# EAGLE design light_controller (EAGLE 8.4.0)
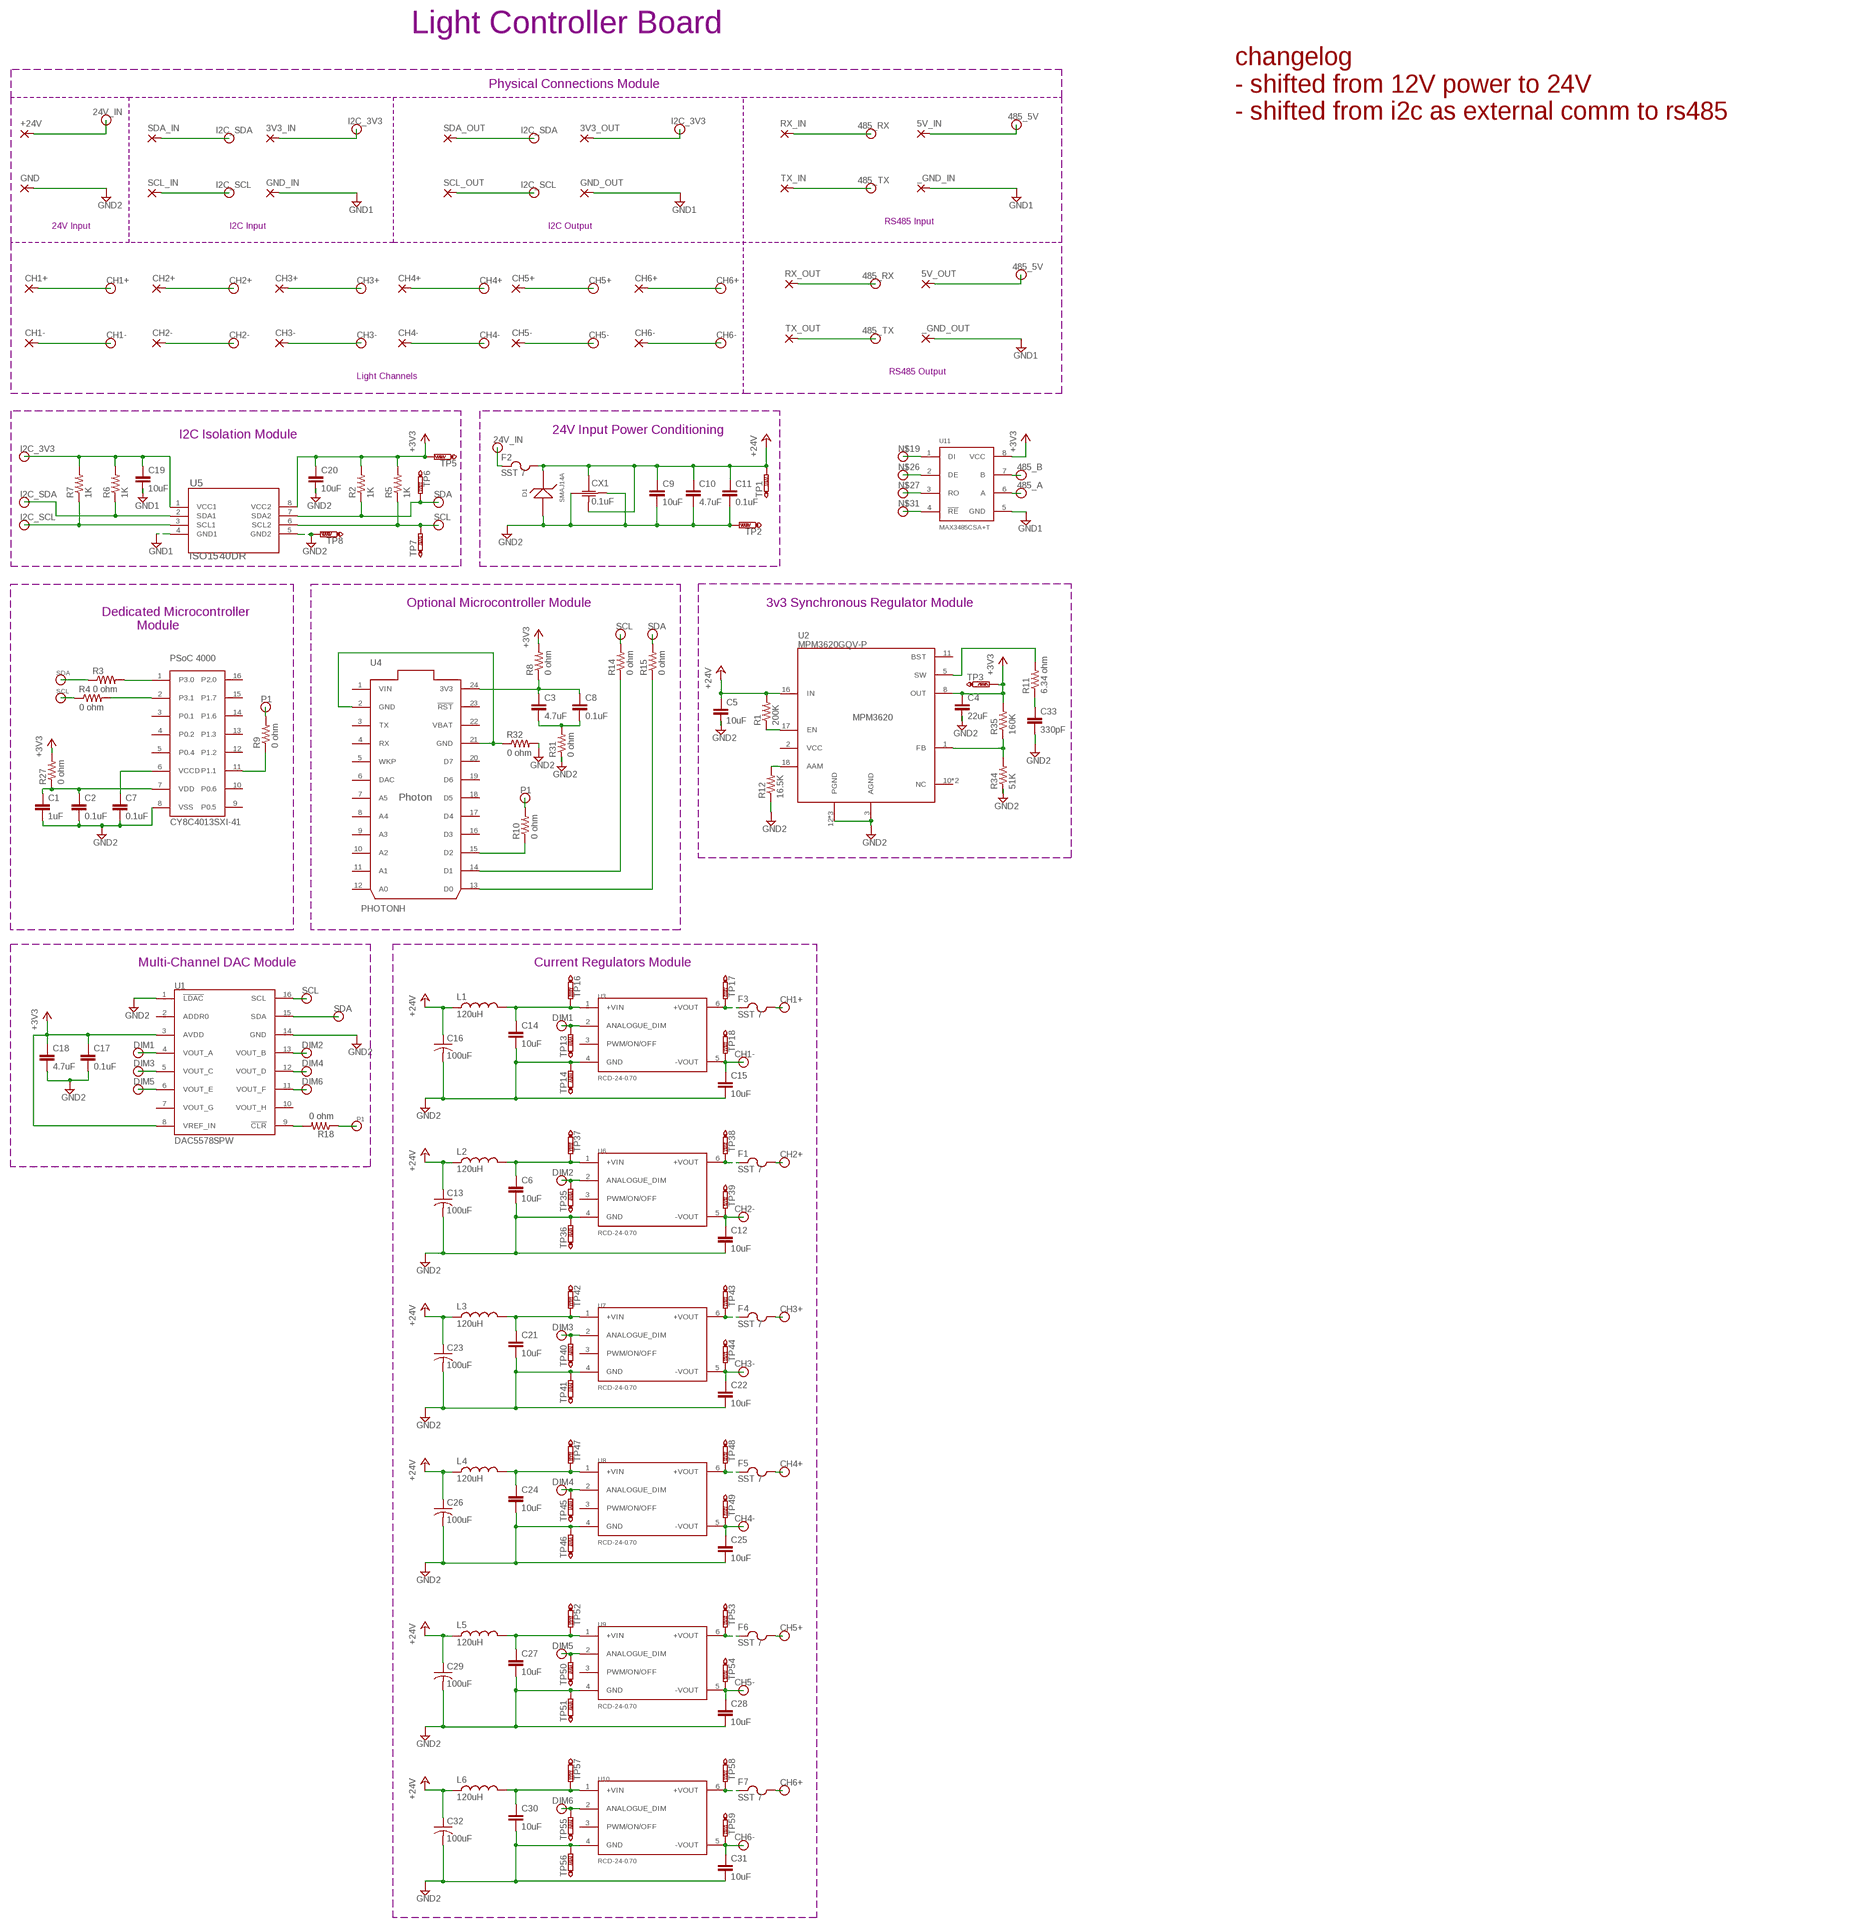
[diagram p0: schematic, sheet 1]

## Parts
3V3_IN  3,17/1,3  [3,17/1,3]
3V3_OUT  3,17/1,3  [3,17/1,3]
5V_IN  3,17/1,3  [3,17/1,3]
5V_OUT  3,17/1,3  [3,17/1,3]
+24V  3,17/1,3  [3,17/1,3]
_GND_IN  3,17/1,3  [3,17/1,3]
_GND_OUT  3,17/1,3  [3,17/1,3]
C1  1uF  1UF-CL10A105KB8NNNC  [C1206]
C2  0.1uF  0.1UF-C1206C104K5RAC7867  [C1206C]
C3  4.7uF  4.7UF-C1206C475K5PACTU  [CAP_C1206]
C4  22uF  22UF-C3216X5R1V226M160AC  [C1206]
C5  10uF  10UF-CL31B106KBHNNNE  [C1206]
C6  10uF  10UF-CL31B106KBHNNNE  [C1206]
C7  0.1uF  0.1UF-C1206C104K5RAC7867  [C1206C]
C8  0.1uF  0.1UF-C1206C104K5RAC7867  [C1206C]
C9  10uF  10UF-CL31B106KBHNNNE  [C1206]
C10  4.7uF  4.7UF-C1206C475K5PACTU  [CAP_C1206]
C11  0.1uF  0.1UF-C1206C104K5RAC7867  [C1206C]
C12  10uF  10UF-CL31B106KBHNNNE  [C1206]
C13  100uF  100UF-EEE-1HA101UP  [EEE-1HA101UP]
C14  10uF  10UF-CL31B106KBHNNNE  [C1206]
C15  10uF  10UF-CL31B106KBHNNNE  [C1206]
C16  100uF  100UF-EEE-1HA101UP  [EEE-1HA101UP]
C17  0.1uF  0.1UF-C1206C104K5RAC7867  [C1206C]
C18  4.7uF  4.7UF-C1206C475K5PACTU  [CAP_C1206]
C19  10uF  10UF-CL31B106KBHNNNE  [C1206]
C20  10uF  10UF-CL31B106KBHNNNE  [C1206]
C21  10uF  10UF-CL31B106KBHNNNE  [C1206]
C22  10uF  10UF-CL31B106KBHNNNE  [C1206]
C23  100uF  100UF-EEE-1HA101UP  [EEE-1HA101UP]
C24  10uF  10UF-CL31B106KBHNNNE  [C1206]
C25  10uF  10UF-CL31B106KBHNNNE  [C1206]
C26  100uF  100UF-EEE-1HA101UP  [EEE-1HA101UP]
C27  10uF  10UF-CL31B106KBHNNNE  [C1206]
C28  10uF  10UF-CL31B106KBHNNNE  [C1206]
C29  100uF  100UF-EEE-1HA101UP  [EEE-1HA101UP]
C30  10uF  10UF-CL31B106KBHNNNE  [C1206]
C31  10uF  10UF-CL31B106KBHNNNE  [C1206]
C32  100uF  100UF-EEE-1HA101UP  [EEE-1HA101UP]
C33  330pF  330PF-CC1206KRX7R9BB331  [C1206]
CH1+  3,17/1,3  [3,17/1,3]
CH1-  3,17/1,3  [3,17/1,3]
CH2+  3,17/1,3  [3,17/1,3]
CH2-  3,17/1,3  [3,17/1,3]
CH3+  3,17/1,3  [3,17/1,3]
CH3-  3,17/1,3  [3,17/1,3]
CH4+  3,17/1,3  [3,17/1,3]
CH4-  3,17/1,3  [3,17/1,3]
CH5+  3,17/1,3  [3,17/1,3]
CH5-  3,17/1,3  [3,17/1,3]
CH6+  3,17/1,3  [3,17/1,3]
CH6-  3,17/1,3  [3,17/1,3]
CX1  0.1uF  0.1UF-X2Y-CX1206MKX7R9BB104  [CX1206]
D1  SMAJ14A  [DO-214AC]
F1  SST 7  SST_7  [SS]
F2  SST 7  SST_7  [SS]
F3  SST 7  SST_7  [SS]
F4  SST 7  SST_7  [SS]
F5  SST 7  SST_7  [SS]
F6  SST 7  SST_7  [SS]
F7  SST 7  SST_7  [SS]
GND  3,17/1,3  [3,17/1,3]
GND_IN  3,17/1,3  [3,17/1,3]
GND_OUT  3,17/1,3  [3,17/1,3]
L1  120uH  120UH-74404064121  [74404064121]
L2  120uH  120UH-74404064121  [74404064121]
L3  120uH  120UH-74404064121  [74404064121]
L4  120uH  120UH-74404064121  [74404064121]
L5  120uH  120UH-74404064121  [74404064121]
L6  120uH  120UH-74404064121  [74404064121]
R1  200K  200K-RC0603JR-07200KL  [RC0603N]
R2  1K  1K-ERJ-PB3D1001V  [RC0603N]
R3  0 ohm  0OHM-ERJ-3GEY0R00V  [RC0603N]
R4  0 ohm  0OHM-ERJ-3GEY0R00V  [RC0603N]
R5  1K  1K-ERJ-PB3D1001V  [RC0603N]
R6  1K  1K-ERJ-PB3D1001V  [RC0603N]
R7  1K  1K-ERJ-PB3D1001V  [RC0603N]
R8  0 ohm  0OHM-ERJ-3GEY0R00V  [RC0603N]
R9  0 ohm  0OHM-ERJ-3GEY0R00V  [RC0603N]
R10  0 ohm  0OHM-ERJ-3GEY0R00V  [RC0603N]
R11  6.34 ohm  6.3OHM-RC0805FR-076R34L  [R0805]
R12  16.5K  16.5K-311-16.5KHRCT-ND  [RC0603N]
R14  0 ohm  0OHM-ERJ-3GEY0R00V  [RC0603N]
R15  0 ohm  0OHM-ERJ-3GEY0R00V  [RC0603N]
R18  0 ohm  0OHM-ERJ-3GEY0R00V  [RC0603N]
R27  0 ohm  0OHM-ERJ-3GEY0R00V  [RC0603N]
R31  0 ohm  0OHM-ERJ-3GEY0R00V  [RC0603N]
R32  0 ohm  0OHM-ERJ-3GEY0R00V  [RC0603N]
R34  51K  51K-RC0603JR-0751KL  [RC0603N]
R35  160K  160K-RC0603JR-07160KL  [RC0603N]
RX_IN  3,17/1,3  [3,17/1,3]
RX_OUT  3,17/1,3  [3,17/1,3]
SCL_IN  3,17/1,3  [3,17/1,3]
SCL_OUT  3,17/1,3  [3,17/1,3]
SDA_IN  3,17/1,3  [3,17/1,3]
SDA_OUT  3,17/1,3  [3,17/1,3]
TP1  PTR1B2,54  [B2,54]
TP2  PTR1B2,54  [B2,54]
TP3  PTR1B2,54  [B2,54]
TP5  PTR1B2,54  [B2,54]
TP6  PTR1B2,54  [B2,54]
TP7  PTR1B2,54  [B2,54]
TP8  PTR1B2,54  [B2,54]
TP13  PTR1B2,54  [B2,54]
TP14  PTR1B2,54  [B2,54]
TP16  PTR1B2,54  [B2,54]
TP17  PTR1B2,54  [B2,54]
TP18  PTR1B2,54  [B2,54]
TP35  PTR1B2,54  [B2,54]
TP36  PTR1B2,54  [B2,54]
TP37  PTR1B2,54  [B2,54]
TP38  PTR1B2,54  [B2,54]
TP39  PTR1B2,54  [B2,54]
TP40  PTR1B2,54  [B2,54]
TP41  PTR1B2,54  [B2,54]
TP42  PTR1B2,54  [B2,54]
TP43  PTR1B2,54  [B2,54]
TP44  PTR1B2,54  [B2,54]
TP45  PTR1B2,54  [B2,54]
TP46  PTR1B2,54  [B2,54]
TP47  PTR1B2,54  [B2,54]
TP48  PTR1B2,54  [B2,54]
TP49  PTR1B2,54  [B2,54]
TP50  PTR1B2,54  [B2,54]
TP51  PTR1B2,54  [B2,54]
TP52  PTR1B2,54  [B2,54]
TP53  PTR1B2,54  [B2,54]
TP54  PTR1B2,54  [B2,54]
TP55  PTR1B2,54  [B2,54]
TP56  PTR1B2,54  [B2,54]
TP57  PTR1B2,54  [B2,54]
TP58  PTR1B2,54  [B2,54]
TP59  PTR1B2,54  [B2,54]
TX_IN  3,17/1,3  [3,17/1,3]
TX_OUT  3,17/1,3  [3,17/1,3]
U1  DAC5578SPW  [TSSOP16]
U2  MPM3620GQV-P  [20-POWERLFQFN-MODULE]
U3  RCD-24-0.70  [RCD-24-PINNED]
U4  PHOTONH  PHOTONHPHOTONH  [PHOTON]
U5  ISO1540DR  [D8]
U6  RCD-24-0.70  [RCD-24-PINNED]
U7  RCD-24-0.70  [RCD-24-PINNED]
U8  RCD-24-0.70  [RCD-24-PINNED]
U9  RCD-24-0.70  [RCD-24-PINNED]
U10  RCD-24-0.70  [RCD-24-PINNED]
U11  MAX3485CSA+T  [SOIC8]
U$2  CY8C4013SXI-41  [SOIC16]

## Nets
24V_IN: +24V.1(P) F2.1
485_5V: 5V_IN.1(P) 5V_OUT.1(P)
485_A: U11.6(A)
485_B: U11.7(B)
485_RX: RX_IN.1(P) RX_OUT.1(P)
485_TX: TX_IN.1(P) TX_OUT.1(P)
+3V3: C4.1 C17.1 C18.1 C20.1 R2.2 R5.2 R8.2 R27.2 R35.2 TP3.TP TP5.TP U1.3(AVDD) U1.8(VREF_IN) U2.8(OUT) U5.8(VCC2) U11.8(VCC)
+24V: C5.1 C9.1 C10.1 C11.1 C13.+(1(+)) C16.+(1(+)) C23.+(1(+)) C26.+(1(+)) C29.+(1(+)) C32.+(1(+)) CX1.1 CX1.2 D1.C F2.2 L1.1 L2.1 L3.1 L4.1 L5.1 L6.1 R1.2 TP1.TP U2.16(IN)
CH1+: CH1+.1(P) F3.2
CH1-: C15.1 CH1-.1(P) TP18.TP U3.5(-VOUT)
CH2+: CH2+.1(P) F1.2
CH2-: C12.1 CH2-.1(P) TP39.TP U6.5(-VOUT)
CH3+: CH3+.1(P) F4.2
CH3-: C22.1 CH3-.1(P) TP44.TP U7.5(-VOUT)
CH4+: CH4+.1(P) F5.2
CH4-: C25.1 CH4-.1(P) TP49.TP U8.5(-VOUT)
CH5+: CH5+.1(P) F6.2
CH5-: C28.1 CH5-.1(P) TP54.TP U9.5(-VOUT)
CH6+: CH6+.1(P) F7.2
CH6-: C31.1 CH6-.1(P) TP59.TP U10.5(-VOUT)
DIM1: TP13.TP U1.4(VOUT_A) U3.2(ANALOGUE_DIM)
DIM2: TP35.TP U1.13(VOUT_B) U6.2(ANALOGUE_DIM)
DIM3: TP40.TP U1.5(VOUT_C) U7.2(ANALOGUE_DIM)
DIM4: TP45.TP U1.12(VOUT_D) U8.2(ANALOGUE_DIM)
DIM5: TP50.TP U1.6(VOUT_E) U9.2(ANALOGUE_DIM)
DIM6: TP55.TP U1.11(VOUT_F) U10.2(ANALOGUE_DIM)
GND1: _GND_IN.1(P) _GND_OUT.1(P) C19.2 GND_IN.1(P) GND_OUT.1(P) U5.4(GND1) U11.5(GND)
GND2: C1.2 C2.2 C4.2 C5.2 C6.2 C7.2 C9.2 C10.2 C11.2 C12.2 C13.-(2(-)) C14.2 C15.2 C16.-(2(-)) C17.2 C18.2 C20.2 C21.2 C22.2 C23.-(2(-)) C24.2 C25.2 C26.-(2(-)) C27.2 C28.2 C29.-(2(-)) C30.2 C31.2 C32.-(2(-)) C33.2 CX1.3 CX1.4 D1.A GND.1(P) R12.1 R31.1 R32.2 R34.1 TP2.TP TP8.TP TP14.TP TP36.TP TP41.TP TP46.TP TP51.TP TP56.TP U1.1(!LDAC!) U1.14(GND) U2.3(AGND) U2.12(PGND) U2.13(PGND) U2.14(PGND) U3.4(GND) U5.5(GND2) U6.4(GND) U7.4(GND) U8.4(GND) U9.4(GND) U10.4(GND) U$2.8(VSS)
I2C_3V3: 3V3_IN.1(P) 3V3_OUT.1(P) C19.1 R6.2 R7.2 U5.1(VCC1)
I2C_SCL: R7.1 SCL_IN.1(P) SCL_OUT.1(P) U5.3(SCL1)
I2C_SDA: R6.1 SDA_IN.1(P) SDA_OUT.1(P) U5.2(SDA1)
N$1: R3.2 U$2.1(P3.0)
N$2: R4.2 U$2.2(P3.1)
N$3: C14.1 L1.2 TP16.TP U3.1(+VIN)
N$4: R9.1 U$2.11(P1.1)
N$5: F3.1 TP17.TP U3.6(+VOUT)
N$6: C6.1 L2.2 TP37.TP U6.1(+VIN)
N$7: R10.1 U4.15(D2)
N$8: R18.2 U1.9(!CLR!)
N$9: F1.1 TP38.TP U6.6(+VOUT)
N$10: C21.1 L3.2 TP42.TP U7.1(+VIN)
N$11: F4.1 TP43.TP U7.6(+VOUT)
N$12: C24.1 L4.2 TP47.TP U8.1(+VIN)
N$13: F5.1 TP48.TP U8.6(+VOUT)
N$14: C27.1 L5.2 TP52.TP U9.1(+VIN)
N$15: R11.2 U2.5(SW)
N$16: C1.1 C2.1 R27.1 U$2.7(VDD)
N$17: C33.1 R11.1
N$18: R12.2 U2.18(AAM)
N$19: U11.1(DI)
N$20: C3.2 C8.2 R31.2
N$21: F6.1 TP53.TP U9.6(+VOUT)
N$22: R14.1 U4.14(D1)
N$23: C3.1 C8.1 R8.1 U4.24(3V3)
N$24: C30.1 L6.2 TP57.TP U10.1(+VIN)
N$25: F7.1 TP58.TP U10.6(+VOUT)
N$26: U11.2(DE)
N$27: U11.3(RO)
N$28: R15.1 U4.13(D0)
N$29: C7.1 U$2.6(VCCD)
N$30: R32.1 U4.2(GND) U4.21(GND)
N$31: U11.4(!RE!)
N$32: R1.1 U2.17(EN)
N$33: R34.2 R35.1 U2.1(FB)
P1: R9.2 R10.2 R18.1
SCL: R4.1 R5.1 R14.2 TP7.TP U1.16(SCL) U5.6(SCL2)
SDA: R2.1 R3.1 R15.2 TP6.TP U1.15(SDA) U5.7(SDA2)
Unconnected: U1.2(ADDR0) U1.7(VOUT_G) U1.10(VOUT_H) U2.2(VCC) U2.10(NC) U2.11(BST) U2.15(NC) U3.3(PWM/ON/OFF) U4.3(TX) U4.4(RX) U4.5(WKP) U4.6(DAC) U4.7(A5) U4.8(A4) U4.9(A3) U4.10(A2) U4.11(A1) U4.12(A0) U4.16(D3) U4.17(D4) U4.18(D5) U4.19(D6) U4.20(D7) U4.23(!RST) U6.3(PWM/ON/OFF) U7.3(PWM/ON/OFF) U8.3(PWM/ON/OFF) U9.3(PWM/ON/OFF) U10.3(PWM/ON/OFF) U$2.3(P0.1) U$2.4(P0.2) U$2.5(P0.4) U$2.9(P0.5) U$2.10(P0.6) U$2.12(P1.2) U$2.13(P1.3) U$2.14(P1.6) U$2.15(P1.7) U$2.16(P2.0)

## Notes on the sheet
- Light Controller Board
- Physical Connections Module
- changelog
  - shifted from 12V power to 24V
  - shifted from i2c as external comm to rs485
- RS485 Input
- 24V Input | I2C Input | I2C Output
- RS485 Output
- Light Channels
- 24V Input Power Conditioning
- I2C Isolation Module
- Optional Microcontroller Module | 3v3 Synchronous Regulator Module
- Dedicated Microcontroller
            Module
- Multi-Channel DAC Module | Current Regulators Module

## Power pins joined to a net without a drawn wire
VBAT: U4.22(VBAT)
VIN: U4.1(VIN)

## Library data of the parts
3V3_IN 3V3_OUT 5V_IN 5V_OUT +24V _GND_IN _GND_OUT CH1+ CH1- CH2+ CH2- CH3+ CH3- CH4+ CH4- CH5+ CH5- CH6+ CH6- GND GND_IN GND_OUT RX_IN RX_OUT SCL_IN SCL_OUT SDA_IN SDA_OUT TX_IN TX_OUT = openag-wirepads:3,17/1,3: THROUGH-HOLE PAD
C1 = openag-capacitors:1UF-CL10A105KB8NNNC: Samsung - CL10A105KB8NNNC - CAP CER 1UF 50V X5R 0603 Description: 1µF ±10% 50V Ceramic Capacitor X5R 0603 (1608 Metric) Technical Specifications: Capacitance: 1µF Tolerance: ±10% Rated Voltage: 50V Temperature Coefficient: X5R Operating Temperature: -55°C ~ 85°C Packaging / Case: 0603 (1608 Metric) Datasheet(s): CL10A105KB8NNNC Spec <http://www.samsungsem.com/kr/support/product-search/mlcc/CL10A105KB8NNNC.jsp> Vendor(s): Digikey: 1276-1860-1-ND <https://www.digikey.com/product-detail/en/samsung-electro-mechanics-america-inc/CL10A105KB8NNNC/1276-1860-1-ND/3889946>; POPULATE: YES; VERIFIED: NO
C2 C7 C8 C11 C17 = openag-capacitors:0.1UF-C1206C104K5RAC7867: Kemet - C1206C104K5RAC7867 - CAP CER 0.1UF 50V X7R 1206 Description: 0.1µF ±10% 50V Ceramic Capacitor X7R 1206 (3216 Metric) Technical Specifications: Capacitance: 0.1uF Tolerance ±10% Rated Voltage: 50V Temperature Coefficient: X7R Operating Temperature: -55°C ~ 125°C Package / Case: 1206 (3216 Metric) Datasheet(s): X7R Dielectric, 6.3-250 VDC <https://content.kemet.com/datasheets/KEM_C1002_X7R_SMD.pdf> Vendor(s): Digikey: 399-1249-1-ND <https://www.digikey.com/product-detail/en/kemet/C1206C104K5RAC7867/399-1249-1-ND/411524>; POPULATE: YES; VERIFIED: NO
C3 C10 C18 = openag-capacitors:4.7UF-C1206C475K5PACTU: Kemet - C1206C475K5PACTU - CAP CER 4.7UF 50V X5R 1206 Description: 4.7µF ±10% 50V Ceramic Capacitor X5R 1206 (3216 Metric) Technical Specifications: Capacitance: 4.7uF Tolerance: ±10% Rated Voltage: 50V Temperature Coefficient: X5R Operating Temperature: -55°C ~ 85°C Package/Case: 1206 (3216 Metric) Datasheet(s): https://media.digikey.com/pdf/Data%20Sheets/Kemet%20PDFs/C1206C475K5PAC.pdf Vendor(s): Digikey: 399-5507-1-ND <https://www.digikey.com/product-detail/en/kemet/C1206C475K5PACTU/399-5507-1-ND/1950685>; POPULATE: YES; VERIFIED: NO
C4 = openag-capacitors:22UF-C3216X5R1V226M160AC: TDK Corp - C3216X5R1V226M160AC - CAP CER 22UF 35V X5R 1206 Description: 22µF ±20% 35V Ceramic Capacitor X5R 1206 (3216 Metric) Technical Specifications: Capacitance: 22µF Tolerance: ±20% Rated Voltage: 35V Temperature Coefficient: X5R Operating Temperature: -55°C ~ 85°C Package / Case: 1206 (3216 Metric) Datasheet(s): C3216X5R1V226M160AC Character Sheet <https://product.tdk.com/info/en/documents/chara_sheet/C3216X5R1V226M160AC.pdf> C Series, General Datasheet <https://product.tdk.com/info/en/catalog/datasheets/mlcc_commercial_general_en.pdf> Vendor(s): Digikey: 445-8045-1-ND <https://www.digikey.com/product-detail/en/tdk-corporation/C3216X5R1V226M160AC/445-8045-1-ND/2792165>; POPULATE: YES; VERIFIED: NO
C5 C6 C9 C12 C14 C15 C19-C22 C24 C25 C27 C28 C30 C31 = openag-capacitors:10UF-CL31B106KBHNNNE: Samsung - CL31B106KBHNNNE - CAP CER 10UF 50V X7R 1206 Description: 10µF ±10% 50V Ceramic Capacitor X7R 1206 (3216 Metric) Technical Specifications: Capacitance: 10uF Tolerance: ±10% Rated Voltage: 50V Temperature Coefficient: X7R Operating Temperature: -55°C ~ -125°C Package/Case: 1206 (3216 Metric) Datasheet(s): CL Series, MLCC Datasheet <https://media.digikey.com/pdf/Data%20Sheets/Samsung%20PDFs/CL_Series_MLCC_ds.pdf> Vendor(s): Digikey: 1276-6767-1-ND <https://www.digikey.com/product-detail/en/samsung-electro-mechanics-america-inc/CL31B106KBHNNNE/1276-6767-1-ND/5961626>; POPULATE: YES; VERIFIED: NO
C13 C16 C23 C26 C29 C32 = openag-capacitors:100UF-EEE-1HA101UP: Panasonic - EEE-1HA101UP - ELECTROLYTIC CAP ALUM 100UF 20% 50V SMD Description: 100µF 50V Aluminum Electrolytic Capacitors Radial, Can - SMD 2000 Hrs @ 85°C Technical Specifications: Capacitance: 100uF Tolerance: ±20% Rated Voltage: 50V Polarization: Polar Operating Temperature: -40°C ~ 85°C Datasheet(s): S Series, Type V <https://industrial.panasonic.com/cdbs/www-data/pdf/RDE0000/ABA0000C1145.pdf> Vendor(s): Digikey: PCE3917CT-ND <https://www.digikey.com/product-detail/en/panasonic-electronic-components/EEE-1HA101UP/PCE3917CT-ND/766293>; POPULATED: YES; VERIFIED: NO
C33 = openag-capacitors:330PF-CC1206KRX7R9BB331: Yageo - CC1206KRX7R9BB331 - CAP CER 330PF 50V X7R 1206 Description: 330pF ±10% 50V Ceramic Capacitor X7R 1206 (3216 Metric) Technical Specifications: Capacitance: 330pF Tolerance: ±10% Rated Voltage: 50V Temperature Coefficient: X7R Operating Temperature: -55°C ~ 125°C Package / Case: 1206 (3216 Metric) Datasheet(s): CC Series, Class 2 X7R Datasheet <http://www.yageo.com/documents/recent/UPY-GPHC_X7R_6.3V-to-50V_18.pdf> Vendor(s): Digikey: 311-1166-1-ND <https://www.digikey.com/product-detail/en/yageo/CC1206KRX7R9BB331/311-1166-1-ND/303076>; POPULATE: YES; VERIFIED: NO
CX1 = openag-capacitors:0.1UF-X2Y-CX1206MKX7R9BB104: Yageo - CX1206MKX7R9BB104 - CAP CER 0.1UF 50V X7R 1206 Description: 0.1µF ±20% 50V Ceramic Capacitor X7R 1206 (3216 Metric) Technical Specifications: Capacitance: 0.1uF Tolerance: ±20% Rated Voltage: 50V Temperature Coefficient: X7R Operating Temperature: -55°C ~ 125°C Features: Low ESL (X2Y) Package / Case: 1206 (3216 Metric) Datasheet(s): EMI Filter X2Y Series <http://www.yageo.com/NewPortal/_en/search/productDocs.jsp?YageoPartNumber=CX1206MKX7R9BB104> Vendor(s): Digikey: 311-1261-1-ND <https://www.digikey.com/product-detail/en/yageo/CX1206MKX7R9BB104/311-1261-1-ND/1645005>; POPULATE: YES; VERIFIED: NO
D1 = openag-diodes:SMAJ14A: TVS DIODE 14VWM 23.2VC SMA - Littlefuse - SMAJ14A - SMAJ14ALFCT-ND Description: The SMAJ series is designed specifically to protect sensitive electronic equipment from voltage transients induced by lightning and other transient voltage events Technical Specifications: Type: Zener Voltage - Reverse Standoff (Typ): 14V Voltage - Breakdown (Min): 15.6V Voltage - Clamping (Max) @ Ipp: 23.2V Current - Peak Pulse (10/1000µs): 17.2A Operating Temperature: -55°C ~ 150°C (TJ) Mounting Type: Surface Mount Package / Case: DO-214AC, SMA Datasheet(s): SMAJ Series <http://www.littelfuse.com/~/media/electronics/datasheets/tvs_diodes/littelfuse_tvs_diode_smaj_datasheet.pdf.pdf> Vendor(s): Digikey: SMAJ14ALFCT-ND <https://www.digikey.com/product-detail/en/littelfuse-inc/SMAJ14A/SMAJ14ALFCT-ND/762486>; POPULATE: YES; VERIFIED: NO
F1-F7 = openag-fuses:SST_7: Bel Fuse - SST7 - FUSE BRD MNT 7A 125VAC/VDC 2SMD Description: FUSE BRD MNT 7A 125VAC/VDC 2SMD Technical Specifications: Current Rating: 7A Voltage Rating: 125V Fuse Type: Board Mount (Cartridge Style Excluded) Mounting Type: Surface Mount Operating Temperature: -55°C ~ 125°C Datasheet(s): SST Type <https://belfuse.com/resources/StewartConnector/SST.pdf> Vendor(s): Digikey: 507-1072-1-ND <https://www.digikey.com/product-detail/en/bel-fuse-inc/SST-7/507-1072-1-ND/615026>; POPULATE: YES; VERIFIED: NO
L1-L6 = openag-inductors:120UH-74404064121: Wurth Electronics - 74404064121 - FIXED IND 120UH 790MA 520 MOHM Technical Specifications: Inductance: 120uH Rated Current: 790mA Saturation Current: 980mA DC Resistance: 520mΩ Operating Temperature: -40° C to 125°C Datasheet(s): 74404064121 Drawing <http://katalog.we-online.de/pbs/datasheet/74404064121.pdf> Vendors: Digikey: 732-7258-1-ND <https://www.digikey.com/product-detail/en/wurth-electronics-inc/74404064121/732-7258-1-ND/5353238>; POPULATE: YES; VERIFIED: NO
R1 = openag-resistors:200K-RC0603JR-07200KL: Yageo - RC0603JR-07200KL - RES SMD 200K OHM 5% 1/10W 0603 Description: 200 kOhms ±5% 0.1W, 1/10W Chip Resistor 0603 (1608 Metric) Moisture Resistant Thick Film Technical Specifications: Resistance: 200 kOhms Tolerance: ±5% Power: 0.1W, 1/10W Temperature Coefficient: ±100ppm/°C Operating Temperature: -55°C ~ 155°C Package / Case: 0603 (1608 Metric) Datasheet(s): RC Series, L Datasheet <http://www.yageo.com/documents/recent/PYu-RC_Group_51_RoHS_L_8.pdf> Vendor(s): Digikey: 311-200KGRCT-ND <https://www.digikey.com/product-detail/en/yageo/RC0603JR-07200KL/311-200KGRCT-ND/729685>; POPULATE: NO; VERIFIED: NO
R2 R5-R7 = openag-resistors:1K-ERJ-PB3D1001V: Panasonic - P20283CT-ND - RES SMD 1K OHM 0.5% 1/5W 0603 Description: 1 kOhms ±0.5% 0.2W, 1/5W Chip Resistor 0603 (1608 Metric) Automotive AEC-Q200, Pulse Withstanding Thick Film Technical Specifications: Resistance: 1 kOhms Tolerance: ±0.5% Power: 0.2W, 1/5W Operating Temperature: -55°C ~ 155°C Package / Case: 0603 (1608 Metric) Datasheet(s): ERJ-PB3, PB6 Series, High Precision Datasheet <https://industrial.panasonic.com/cdbs/www-data/pdf/RDM0000/AOA0000C328.pdf> Vendor(s): Digikey: P20283CT-ND <https://www.digikey.com/product-detail/en/panasonic-electronic-components/ERJ-PB3D1001V/P20283CT-ND/6214538>; POPULATE: YES; VERIFIED: NO
R3 R4 R8-R10 R14 R15 R18 R27 R31 R32 = openag-resistors:0OHM-ERJ-3GEY0R00V: Panasonic - ERJ-3GEY0R00V - RES SMD 0 OHM JUMPER 1/10W 0603 Description: 0 Ohms Jumper 0.1W, 1/10W Chip Resistor 0603 (1608 Metric) Automotive AEC-Q200 Thick Film Technical Specifications: Useful Info Resistance: 0 Ohms Tolerance: Jumper Power: 0.1W, 1/10W Operating Temperature: -55°C ~ 155°C Package/Case: 0603 (1608 Metric) Datasheet(s): ERJ-3GEY0R00V View All Specifications <http://industrial.panasonic.com/www-cgi/jvcr13pz.cgi?E+PZ+3+AOA0001+ERJ3GEY0R00V+7+WW> Vendor(s): Vendor Name: P0.0GCT-ND <https://www.digikey.com/product-detail/en/panasonic-electronic-components/ERJ-3GEY0R00V/P0.0GCT-ND/134711>; POPULATE: YES; VERIFIED: NO
R11 = openag-resistors:6.3OHM-RC0805FR-076R34L: Yageo - RC0805FR-076R34L - RES SMD 6.34 OHM 1% 1/8W 0805 Description: 6.34 Ohms ±1% 0.125W, 1/8W Chip Resistor 0805 (2012 Metric) Moisture Resistant Thick Film Technical Specifications: Resistance: 6.34 Ohms Tolerance: ±1% Power: 0.125W, 1/8W Temperature Coefficient: ±200ppm/°C Operating Temperature: -55°C ~ 155°C Packaging / Case: 0805 (2012 Metric) Datasheet(s): RC Series, L Datasheet Vendor(s): Digikey: 311-6.34CRCT-ND <https://www.digikey.com/product-detail/en/yageo/RC0805FR-076R34L/311-6.34CRCT-ND/731003>; POPULATE: YES; VERIFIED: NO
R12 = openag-resistors:16.5K-311-16.5KHRCT-ND: Yageo - 311-16.5KHRCT-ND - RES SMD 16.5K OHM 1% 1/10W 0603 Description: 16.5 kOhms ±1% 0.1W, 1/10W Chip Resistor 0603 (1608 Metric) Moisture Resistant Thick Film Technical Specifications: Resistance: 16.5 kOhms Tolerance: ±1% Power: 0.1W, 1/10W Temperature Coefficient: ±100ppm/°C Operating Temperature: -55°C ~ 155°C Package / Case: 0603 (1608 Metric) Datasheet(s): RC Series, L Datasheet <http://www.yageo.com/documents/recent/PYu-RC_Group_51_RoHS_L_8.pdf> Vendor(s): https://www.digikey.com/product-detail/en/yageo/RC0603FR-0716K5L/311-16.5KHRCT-ND/729916: 311-16.5KHRCT-ND <link to part>; POPULATE: YES; VERIFIED: NO
R34 = openag-resistors:51K-RC0603JR-0751KL: Yageo - RC0603JR-0751KL - RES SMD 51K OHM 5% 1/10W 0603 Description: 51 kOhms ±5% 0.1W, 1/10W Chip Resistor 0603 (1608 Metric) Moisture Resistant Thick Film Technical Specifications: Resistance: 51 kOhms Tolerance: ±5% Power: 0.1W, 1/10W Temperature Coefficient: ±100ppm/°C Operating Temperature: -55°C ~ 155°C Package / Case: 0603 (1608 Metric) Datasheet(s): RC Series, L Datasheet <http://www.yageo.com/documents/recent/PYu-RC_Group_51_RoHS_L_7.pdf> Vendor(s): Digikey: 311-51KGRCT-ND <https://www.digikey.com/product-detail/en/yageo/RC0603JR-0751KL/311-51KGRCT-ND/729751>; POPULATE: YES; VERIFIED: NO
R35 = openag-resistors:160K-RC0603JR-07160KL: Yageo - RC0603JR-07160KL - RES SMD 160K OHM 5% 1/10W 0603 Description: 160 kOhms ±5% 0.1W, 1/10W Chip Resistor 0603 (1608 Metric) Moisture Resistant Thick Film Technical Specifications: Resistance: 160 kOhms Tolerance: ±5% Power: 0.1W, 1/10W Temperature Coefficient: ±100ppm/°C Operating Temperature: -55°C ~ 155°C Package / Case: 0603 (1608 Metric) Datasheet(s): RC Series, L Datasheet Vendor(s): Digikey: 311-160KGRCT-ND <https://www.digikey.com/product-detail/en/yageo/RC0603JR-07160KL/311-160KGRCT-ND/729666>; POPULATE: YES; VERIFIED: NO
TP1-TP3 TP5-TP8 TP13 TP14 TP16-TP18 TP35-TP59 = openag-testpoints:PTR1: TEST PIN; POPULATE: YES; VERIFIED: NO
U1 = openag-dacs:DAC5578SPW: Texas Instruments - DAC5578SPW Description: 8 Bit Digital to Analog Converter 8 16-TSSOP Technical Specifications: Number of Bits: 8-bit Number of D/A Converters: 8 Settling Time: 12us Operating Voltage: 2.7V - 5.5V Operating Temperature: -40° C to 125°C Max IDD (Normal Mode): 1.4mA Output Short Circuit Current (Individual): 25mA Datasheet(s): DAC5578,6578,7578 <http://www.ti.com/lit/ds/symlink/dac5578.pdf> Vendor(s): Digikey: 296-27736-5-ND <https://www.digikey.com/product-detail/en/texas-instruments/DAC5578SPW/296-27736-5-ND/2360827>; MPN: DAC5578SPW; POPULATE: YES; VERIFIED: NO
U2 = openag-regulators:MPM3620GQV-P: Monolithic Power Systems - MPM3620GQV-P - IC REG BUCK ADJ 2A SYNC 20QFN Technical Specifications: Type: Non-Isolated PoL Module Number of Outputs: 1 Input Voltage: 4.5V ~ 24V Output Voltage: 0.8V ~ 18.48V Max Current Output: 2A Operating Temperature: -40°C ~ 125°C Mounting Type: Surface Mount Package / Case: 20-PowerLFQFN Module Datasheet(s): MPM3620 Datasheet <http://www.monolithicpower.com/DesktopModules/DocumentManage/API/Document/getDocument?id=3021> Vendor(s): Digikey: 1589-1252-2-ND <https://www.digikey.com/product-detail/en/monolithic-power-systems-inc/MPM3620GQV-P/1589-1252-2-ND/5299009>; POPULATE: YES; VERIFIED: NO
U3 U6-U10 = openag-regulators:RCD-24-0.70: Recom Power - RCD-24-0.70 - LED SUPPLY CC BUCK 2-35V 700MA Description: 700mA 2 ~ 35 V Constant Current LED Driver Buck Topology 1 Output Technical Specifications: Output Current: 700mA Input Voltage: 4.5V ~ 36V Output Voltage: 2V ~ 35V Dimming: Analog, PWM Analogue Dimming Input Voltage Limit (Vref Version): -0.3V ~ 5V Analogue Dimming Max Drive Current (Vc=5V): 0.2mA Operating Temperature: -40°C ~ 71°C Efficiency: 96% Datasheet(s): RCD-24 Series <https://www.recom-power.com/pdf/Lightline/RCD-24.pdf> Vendors: Digikey: 945-1123-ND <https://www.digikey.com/product-detail/en/recom-power/RCD-24-0.70/945-1123-ND/2256303>; POPULATE: YES; VERIFIED: NO
U4 = openag-microcontrollers:PHOTONH: PARTICLE - PHOTONH - Tiny Wi-Fi dev board w/cloud backend Description: The Photon is a $19 tiny Wi-Fi development kit for creating connected projects and products for the Internet of Things. It's easy to use, it's powerful, and it's connected to the cloud. Technical Specifications: Processor: STM32F205RGY6 120Mhz ARM Cortex M3 Wireless: 802.11b/g/n Wi-Fi Peripherals: Digital(x18), ADC(x8), DAC(x2), SPI(x2), I2S(x1), I2C(x1) SPI, CAN(1), USB(1), PWM(9) Memory: 1MB flash, 128KB RAM Cerfifications: FCC, CE and IC Operating Temperature: -20°C ~ 60°C Humidity Range: Non condensing, relative humidity: 95% Supply Input Voltage (VIN): 3.6V ~ 5.5V Supply Input Voltage (3V3): 3.0V ~ 3.6V Max Supply Output Current (VIN): 1A Max Supply Output Current (3V3): 100mA Average Operating Current (WiFi on, @VIN): up to 100mA Peak Operating Current (WiFi on, @VIN): up to 430mA I/O Max Source/Sink Current (Individual): 25mA I/O Max Source/Sinnk Current (Total): 120mA Datasheet(s): Photon Datasheet <https://docs.particle.io/datasheets/photon-datasheet/> Vendor(s): Particle: PHOTONH <https://store.particle.io/products/photon>; POPULATE: YES; VERIFIED: NO
U5 = openag-isolators:ISO1540DR: Texas Instruments - ISO1540DR - DGTL ISO 2.5KV 2CH I2C 8SOIC Description: I²C Digital Isolator 2500Vrms 2 Channel 1Mbps 25kV/µs CMTI 8-SOIC (0.154", 3.90mm Width) Technical Specifications: Technology: Capacitive Coupling Type: I²C Number of Channels: 2 Channel Type: Bidirectional Voltage-Isolation: 2500Vrms Voltage - Supply: 3 V ~ 5.5 V Data Rate: 1Mbps Operating Temperature: -40°C ~ 125°C Package / Case: 8-SOIC (0.154", 3.90mm Width) Max Supply Current (3V ≤ VCC1, VCC2 ≤ 3.6V) Side 1, Side 2: 3.8mA, 3.1mA Datasheet(s): ISO154x <http://www.ti.com/lit/ds/symlink/iso1540.pdf> Vendor(s): Digikey: 296-34871-1-ND <https://www.digikey.com/product-detail/en/texas-instruments/ISO1540DR/296-34871-1-ND/3587214>; POPULATE: YES; VERIFIED: NO
U11 = openag-transceivers:MAX3485CSA+T: Maxim Integrated - MAX3485CSA+T - IC TXRX RS485/422 10MBPS 8SOIC Description: 1/1 Transceiver Half RS422, RS485 8-SOIC Technical Specifications: Protocol: RS232, RS485 Number of Drivers/Receivers: 1/1 Duplex: Half Receiver Hysteresis Data Rate: 10Mbps Voltage Supply: 3 V ~ 3.6 V Operating Temperature: 0°C ~ 70°C Package / Case: 8-SOIC (0.154", 3.90mm Width) Datasheet(s): MAX3483-91 <https://datasheets.maximintegrated.com/en/ds/MAX3483-MAX3491.pdf> Vendor(s): Digikey: MAX3485CSA+CT-ND <https://www.digikey.com/product-detail/en/maxim-integrated/MAX3485CSA-T/MAX3485CSA-CT-ND/5405739>; POPULATE: YES; VERIFIED: NO
U$2 = openag-microcontrollers:CY8C4013SXI-41: Cypress - CY8C4013SXI-411 - IC MCU 32BIT 8KB FLASH 16SOIC Description: ARM Cortex-M0 PSOC 4 CY8C4000 Microcontroller IC 32-Bit 16MHz 8KB (8K x 8) FLASH 16-SOIC Technical Specifications: Core Processor: ARM Cortex-M0 Core Size: 32-Bit Speed: 16MHz Connectivity: I²C Peripherals: Brown-out Detect/Reset, POR, PWM, WDT Number of I/O: 12 Program Memory Size: 8KB (8K x 8) Program Memory Type: FLASH RAM Size: 2K x 8 Voltage - Supply (Vcc/Vdd): 1.71 V ~ 5.5 V Operating Temperature: -40°C ~ 85°C Package/Case: 16-SOIC (0.154", 3.90mm Width) Maximum current executing from flash @ 16MHz (Active Mode): 4.5mA Maximum source/sink current per GPIO: 25mA Maximum total GPIO source/sink current: 85mA Datasheet(s): PSoC 4000 Family Datasheet <http://www.cypress.com/?docID=49214> PSoC 4000 Overview <http://www.cypress.com/?docID=48784> Vendor(s): Digikey: CY8C4013SXI-411-ND <https://www.digikey.com/product-detail/en/cypress-semiconductor-corp/CY8C4013SXI-411/CY8C4013SXI-411-ND/4842997>; POPULATE: YES; VERIFIED: NO

## Board
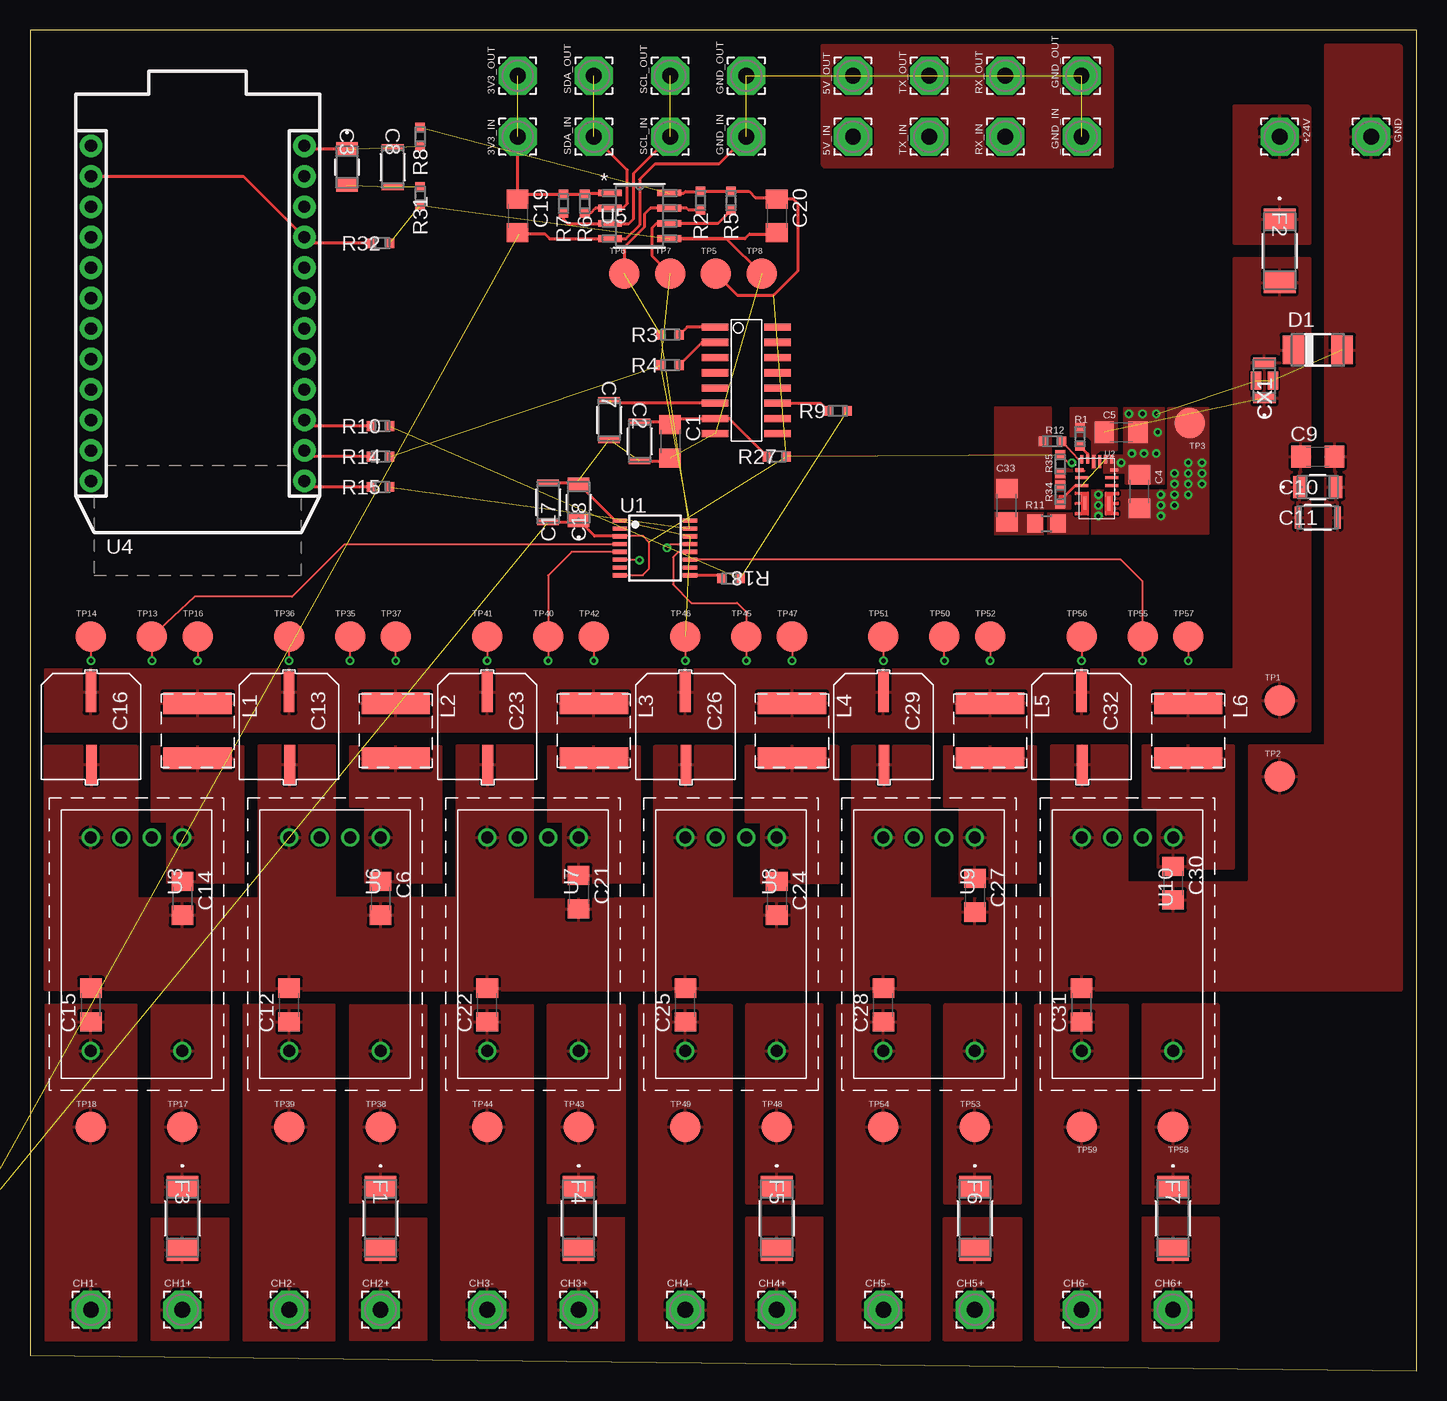
[diagram p1: board, top side]
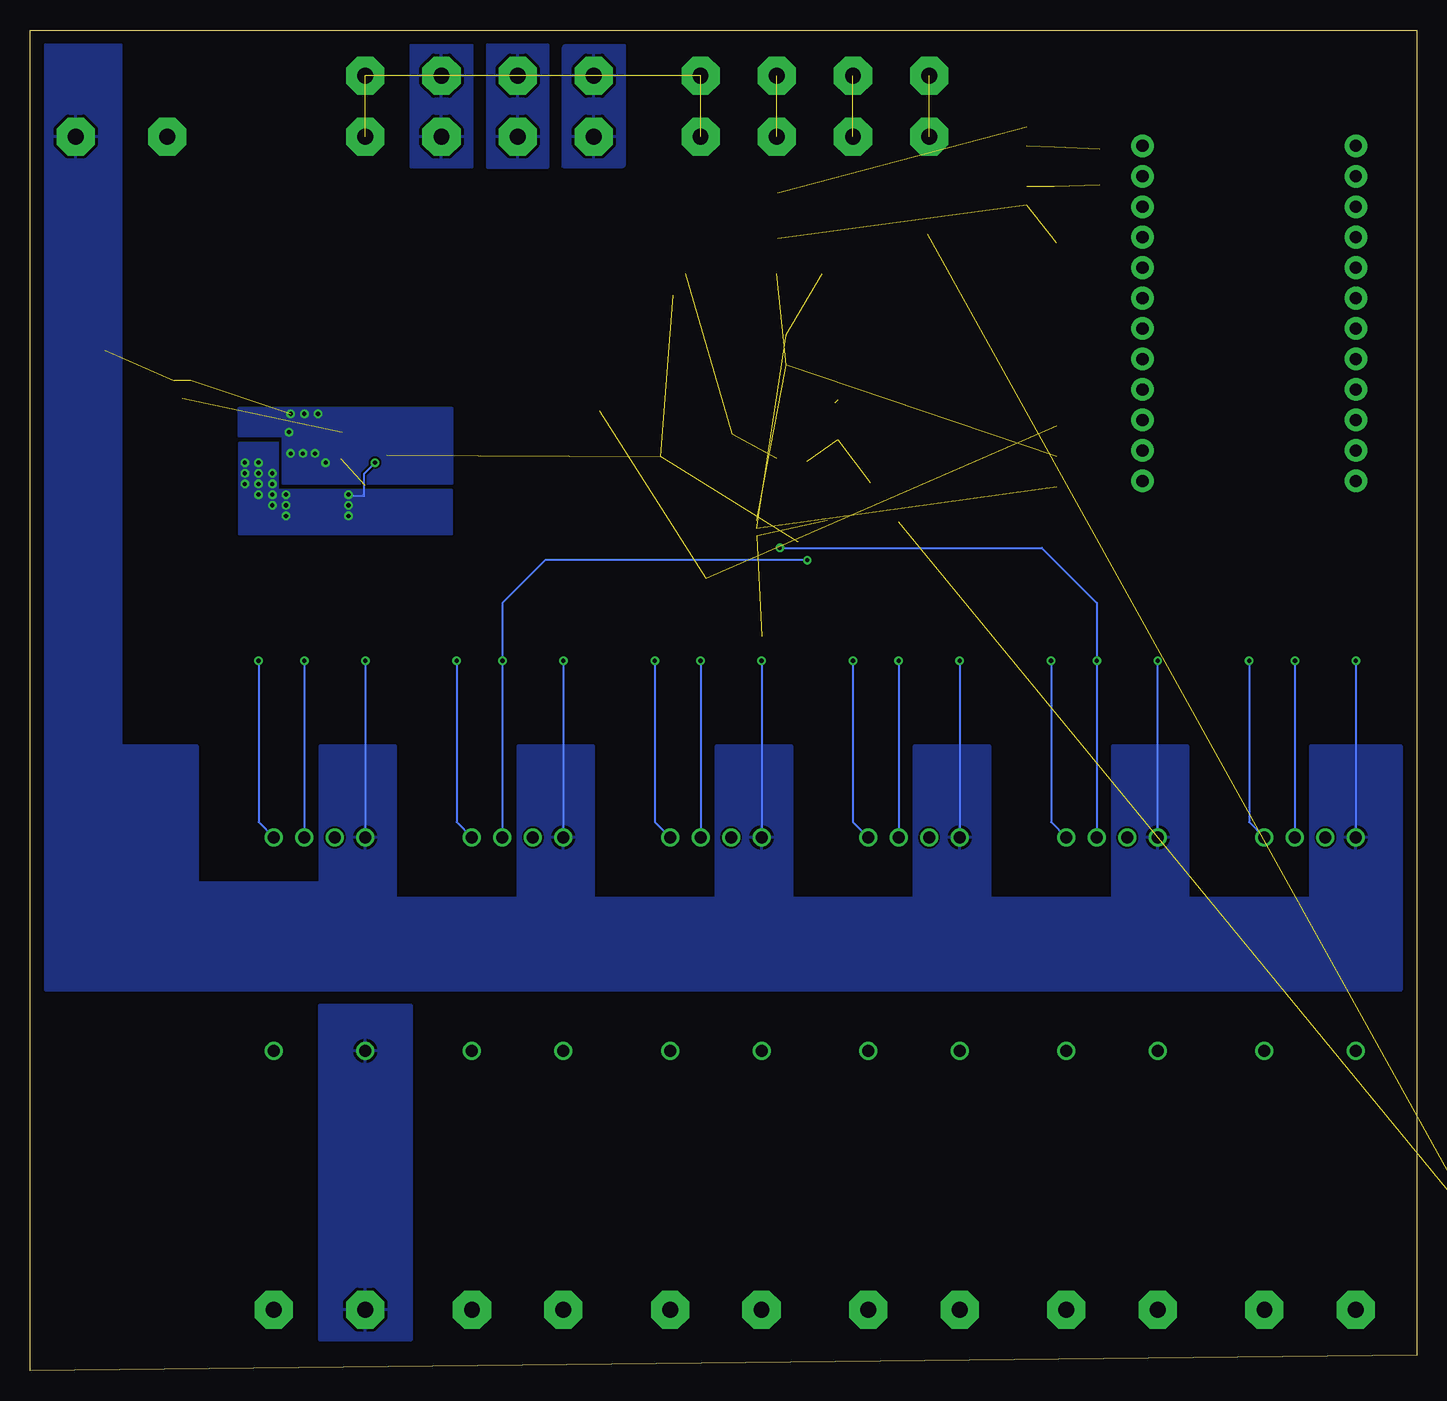
[diagram p2: board, bottom side, seen from below]

Size 115.57 x 111.76 mm. Coordinates in mm from the lower left corner, seen from the top.
Outline: 0,1.27 115.57,0 115.57,111.76 0,111.76 0,1.27
Copper layers (1*16): Top 0.0356mm / dielectric 1.5011mm / Bottom 0.0356mm
Design rules "LaenPCBOrder": minimum track width 6mil, minimum drill 13mil, track to track 6mil, track to pad 6mil, pad to pad 6mil, via to via 6mil, smd to smd 6mil, copper to edge 15mil, drill to drill 6mil, minimum pad ring 7mil, minimum via ring 7mil, stop-mask expansion 3mil, vias tented up to drill 0mil, thermal gap 10mil

### Footprints (pad centres in the part's own frame; a part is rotated, then mirrored left to right if it is on the bottom)
3,17/1,3 = drill 1.321 pad 3.175 octagon: 1 0,0
C1206 = smd 1.6 x 1.8: 1 -1.4,0; 2 1.4,0
C1206C = smd 0.508 x 1.803: 1 -1.651,0; 2 1.651,0
CAP_C1206 = smd 1.118 x 1.803: 1 -1.499,0; 2 1.499,0
EEE-1HA101UP = smd 0.889 x 3.404: + 0,-3.251 | smd 0.889 x 3.251: - -0.051,2.794
CX1206 = smd 0.864 x 1.854: 1 -1.473,0; 2 1.473,0 | smd 1.499 x 0.864: 3 0,0.699; 4 0,-0.699
DO-214AC = smd 1.8 x 2.4: A 2.025,0; C -2.025,0
SS = smd 1.803 x 2.642: 1 -2.629,0; 2 2.629,0
74404064121 = smd 1.8 x 5.7: 1 -2.3,0; 2 2.3,0
RC0603N = smd 0.756 x 0.8: 1 -0.778,0; 2 0.778,0
R0805 = smd 1.3 x 1.5: 1 -0.95,0; 2 0.95,0
B2,54 = smd 2.54 x 2.54: TP 0,0
TSSOP16 = smd 0.35 x 1.2: 1 -2.275,-2.925; 2 -1.625,-2.925; 3 -0.975,-2.925; 4 -0.325,-2.925; 5 0.325,-2.925; 6 0.975,-2.925; 7 1.625,-2.925; 8 2.275,-2.925; 9 2.275,2.925; 10 1.625,2.925; 11 0.975,2.925; 12 0.325,2.925; 13 -0.325,2.925; 14 -0.975,2.925; 15 -1.625,2.925; 16 -2.275,2.925
20-POWERLFQFN-MODULE = smd 0.675 x 0.25: 1 -1.462,1.55 | smd 1.1 x 0.25: 2 -1.25,0.9; 3 -1.25,0.25; 10 1.25,0.25; 11 1.25,0.9 | smd 0.25 x 1.1: 5 -1.01,-1.2; 8 1,-1.27; 15 0.25,2.25; 16 -0.25,2.25 | smd 0.7 x 0.25: 12 1.45,1.55 | smd 0.25 x 0.7: 13 1.25,2.45; 14 0.75,2.45; 17 -0.75,2.45; 18 -1.25,2.45
RCD-24-PINNED = drill 1: 1 0,0; 2 0,-2.54; 3 0,-5.08; 4 0,-7.62; 5 17.78,-7.62; 6 17.78,0
PHOTON = drill 1.016 pad 1.88: 1 1.27,32.258; 2 1.27,29.718; 3 1.27,27.178; 4 1.27,24.638; 5 1.27,22.098; 6 1.27,19.558; 7 1.27,17.018; 8 1.27,14.478; 9 1.27,11.938; 10 1.27,9.398; 11 1.27,6.858; 12 1.27,4.318; 13 19.05,4.318; 14 19.05,6.858; 15 19.05,9.398; 16 19.05,11.938; 17 19.05,14.478; 18 19.05,17.018; 19 19.05,19.558; 20 19.05,22.098; 21 19.05,24.638; 22 19.05,27.178; 23 19.05,29.718; 24 19.05,32.258
D8 = smd 1.981 x 0.559: 1 -2.464,1.905; 2 -2.464,0.635; 3 -2.464,-0.635; 4 -2.464,-1.905; 5 2.464,-1.905; 6 2.464,-0.635; 7 2.464,0.635; 8 2.464,1.905
SOIC8 = smd 0.6 x 1.5: 1 -1.905,-2.75; 2 -0.635,-2.75; 3 0.635,-2.75; 4 1.905,-2.75; 5 1.905,2.75; 6 0.635,2.75; 7 -0.635,2.75; 8 -1.905,2.75
SOIC16 = smd 0.6 x 2.2: 1 4.445,2.6; 2 3.175,2.6; 3 1.905,2.6; 4 0.635,2.6; 5 -0.635,2.6; 6 -1.905,2.6; 7 -3.175,2.6; 8 -4.445,2.6; 9 -4.445,-2.6; 10 -3.175,-2.6; 11 -1.905,-2.6; 12 -0.635,-2.6; 13 0.635,-2.6; 14 1.905,-2.6; 15 3.175,-2.6; 16 4.445,-2.6

### Placement (x,y rotation side)
3V3_IN  40.64,102.87 90 top
3V3_OUT  40.64,107.95 90 top
5V_IN  68.58,102.87 90 top
5V_OUT  68.58,107.95 90 top
+24V  104.14,102.87 270 top
_GND_IN  87.63,102.87 90 top
_GND_OUT  87.63,107.95 90 top
C1  53.34,77.47 270 top
C2  50.8,77.47 270 top
C3  26.42,100.33 270 top
C4  92.46,73.28 90 top
C5  90.93,78.23 0 top
C6  29.21,39.37 270 top
C7  48.26,79.25 270 top
C8  30.23,100.33 270 top
C9  107.31,76.2 0 top
C10  107.31,73.66 0 top
C11  107.31,71.12 0 top
C12  21.59,30.48 90 top
C13  21.59,53.34 180 top
C14  12.7,39.37 270 top
C15  5.08,30.48 90 top
C16  5.08,53.34 180 top
C17  43.18,72.39 90 top
C18  45.72,72.39 90 top
C19  40.64,96.27 270 top
C20  62.23,96.27 270 top
C21  45.72,39.88 270 top
C22  38.1,30.48 90 top
C23  38.1,53.34 180 top
C24  62.23,39.37 270 top
C25  54.61,30.48 90 top
C26  54.61,53.34 180 top
C27  78.74,39.62 270 top
C28  71.12,30.48 90 top
C29  71.12,53.34 180 top
C30  95.25,40.64 270 top
C31  87.63,30.48 90 top
C32  87.63,53.34 180 top
C33  81.41,72.14 90 top
CH1+  12.7,5.08 0 top
CH1-  5.08,5.08 0 top
CH2+  29.21,5.08 0 top
CH2-  21.59,5.08 0 top
CH3+  45.72,5.08 0 top
CH3-  38.1,5.08 0 top
CH4+  62.23,5.08 0 top
CH4-  54.61,5.08 0 top
CH5+  78.74,5.08 0 top
CH5-  71.12,5.08 0 top
CH6+  95.25,5.08 0 top
CH6-  87.63,5.08 0 top
CX1  102.87,82.55 90 top
D1  107.31,85.09 0 top
F1  29.21,12.7 270 top
F2  104.14,93.34 270 top
F3  12.7,12.7 270 top
F4  45.72,12.7 270 top
F5  62.23,12.7 270 top
F6  78.74,12.7 270 top
F7  95.25,12.7 270 top
GND  111.76,102.87 270 top
GND_IN  59.69,102.87 90 top
GND_OUT  59.69,107.95 90 top
L1  13.97,53.34 270 top
L2  30.48,53.34 270 top
L3  46.99,53.34 270 top
L4  63.5,53.34 270 top
L5  80.01,53.34 270 top
L6  96.52,53.34 270 top
R1  87.5,77.85 90 top
R2  55.88,97.54 90 top
R3  53.34,86.36 0 top
R4  53.34,83.82 0 top
R5  58.42,97.54 90 top
R6  46.23,97.28 90 top
R7  44.45,97.28 90 top
R8  32.51,102.87 90 top
R9  67.31,80.01 0 top
R10  29.21,78.74 0 top
R11  84.71,70.61 0 top
R12  85.22,77.47 0 top
R14  29.21,76.2 0 top
R15  29.21,73.66 0 top
R18  58.42,66.04 180 top
R27  62.23,76.2 0 top
R31  32.51,97.92 90 top
R32  29.21,93.98 0 top
R34  85.85,73.02 90 top
R35  85.85,75.56 90 top
RX_IN  81.28,102.87 90 top
RX_OUT  81.28,107.95 90 top
SCL_IN  53.34,102.87 90 top
SCL_OUT  53.34,107.95 90 top
SDA_IN  46.99,102.87 90 top
SDA_OUT  46.99,107.95 90 top
TP1  104.14,55.88 0 top
TP2  104.14,49.53 0 top
TP3  96.65,78.99 180 top
TP5  57.15,91.44 0 top
TP6  49.53,91.44 0 top
TP7  53.34,91.44 0 top
TP8  60.96,91.44 0 top
TP13  10.16,61.21 0 top
TP14  5.08,61.21 0 top
TP16  13.97,61.21 0 top
TP17  12.7,20.32 0 top
TP18  5.08,20.32 0 top
TP35  26.67,61.21 0 top
TP36  21.59,61.21 0 top
TP37  30.48,61.21 0 top
TP38  29.21,20.32 0 top
TP39  21.59,20.32 0 top
TP40  43.18,61.21 0 top
TP41  38.1,61.21 0 top
TP42  46.99,61.21 0 top
TP43  45.72,20.32 0 top
TP44  38.1,20.32 0 top
TP45  59.69,61.21 0 top
TP46  54.61,61.21 0 top
TP47  63.5,61.21 0 top
TP48  62.23,20.32 0 top
TP49  54.61,20.32 0 top
TP50  76.2,61.21 0 top
TP51  71.12,61.21 0 top
TP52  80.01,61.21 0 top
TP53  78.74,20.32 0 top
TP54  71.12,20.32 0 top
TP55  92.71,61.21 0 top
TP56  87.63,61.21 0 top
TP57  96.52,61.21 0 top
TP58  95.25,20.32 180 top
TP59  87.63,20.32 180 top
TX_IN  74.93,102.87 90 top
TX_OUT  74.93,107.95 90 top
U1  52.07,68.58 270 top
U2  88.9,73.53 0 top
U3  12.7,44.45 270 top
U4  3.81,69.85 0 top
U5  50.8,96.27 0 top
U6  29.21,44.45 270 top
U7  45.72,44.45 270 top
U8  62.23,44.45 270 top
U9  78.74,44.45 270 top
U10  95.25,44.45 270 top
U11  -15.24,-5.46 0 top  (outside the outline)
U$2  59.69,82.55 90 top

### Tracks (layer width: path | path; a pad name or v marks a point on that pad's centre or on a via)
24V_IN
  pour Top: 106.68,93.98 106.68,105.16 arc90 106.43,105.41 100.33,105.41 100.33,93.98
485_5V
  pour Bottom: 66.04,110.49 66.04,100.58 arc90 66.29,100.33 71.12,100.33 71.12,110.24 arc90 70.87,110.49
485_RX
  pour Bottom: 78.74,100.33 83.82,100.33 83.82,110.49 78.74,110.49
485_TX
  pour Bottom: 72.39,100.33 72.39,110.49 77.47,110.49 77.47,100.33
+3V3  (via drill 0.35)  (5 unrouted)
  Top 0.152: U1.8 51.06,66.3 51.56,66.8 51.56,69.09 51.09,69.55 U1.3 | R35.2 86.5,75.69 v86.82,75.69
  Top 0.254: U5.8 54.48,98.17 54.61,98.3 55.86,98.3 R2.2 R5.2 59.93,98.31 60.45,97.79 62.11,97.79 C20.1 63.62,97.67 64.01,97.28 64.01,91.69 61.98,89.66 58.93,89.66 TP5.TP | C17.1 45.57,70.74 C18.1 47.06,69.55 U1.3
  Bottom 0.152: v86.82,75.69 87.76,74.75 87.76,72.9 88.9,72.9 v89.03,73.02
  other vias: 89.03,72.14 89.03,71.25 94.23,71.25 94.23,72.14 94.23,73.02 95.38,73.02 95.38,72.14 95.38,73.91 96.52,73.91 97.66,73.91 97.66,74.8 96.52,74.8 95.38,74.8 96.52,75.69 96.52,73.02 97.66,75.69
  pour Top (no thermals): 88.52,73.41 94.87,73.41 94.87,80.26 98.17,80.26 98.17,69.72 88.52,69.72
  pour Bottom: 94.87,77.34 98.17,77.34 98.17,69.72 80.39,69.72 80.39,73.41 94.87,73.41
+24V  (1 unrouted)
  pour Top: 100.33,53.34 100.33,58.42 1.27,58.42 1.27,53.34
  pour Top: 100.33,92.71 100.33,53.34 106.68,53.34 106.68,92.71
  pour Top (no thermals): 88.52,75.18 88.52,77.47 88.14,77.85 86.74,77.85 86.74,80.26 90.55,80.26 90.55,76.71 89.15,76.71 88.77,76.33 88.77,75.18
CH1+
  pour Top: 10.16,12.7 16.51,12.7 16.51,2.54 10.16,2.54
CH1-
  pour Top: 1.27,30.48 1.27,2.54 8.89,2.54 8.89,30.48
CH2+
  pour Top: 33.02,12.7 33.02,2.54 26.67,2.54 26.67,12.7
CH2-
  pour Top: 17.78,30.48 17.78,2.54 25.4,2.54 25.4,30.48
CH3+
  pour Top: 49.53,2.54 49.53,12.7 43.18,12.7 43.18,2.54
CH3-
  pour Top: 34.29,30.48 41.91,30.48 41.91,2.54 34.29,2.54
CH4+
  pour Top: 59.69,2.54 66.04,2.54 66.04,12.7 59.69,12.7
CH4-
  pour Top: 50.8,30.48 58.42,30.48 58.42,2.54 50.8,2.54
CH5+
  pour Top: 82.55,2.54 76.2,2.54 76.2,12.7 82.55,12.7
CH5-
  pour Top: 67.31,30.48 74.93,30.48 74.93,2.54 67.31,2.54
CH6+
  pour Top: 99.06,12.7 92.71,12.7 92.71,2.54 99.06,2.54
CH6-
  pour Top: 83.82,2.54 83.82,30.48 91.44,30.48 91.44,2.54
  pour Bottom: 91.44,30.48 83.82,30.48 83.82,2.54 91.44,2.54
DIM1  (via drill 0.35)
  Top 0.152: U1.4 26.23,68.91 21.84,64.52 13.72,64.52 TP13.TP v10.16,59.18
  Bottom 0.152: v10.16,59.18 U3.2
DIM2  (via drill 0.35)
  Top 0.152: 26.67,62.23 TP35.TP v26.67,59.18 | v53.09,68.58 53.41,68.91 U1.13
  Bottom 0.152: U6.2 v26.67,59.18 26.67,64.01 31.24,68.58 v53.09,68.58
DIM3  (via drill 0.35)
  Top 0.152: U1.5 45.14,68.25 43.18,66.29 TP40.TP v43.18,59.18
  Bottom 0.152: v43.18,59.18 U7.2
DIM4  (via drill 0.35)
  Top 0.152: 59.69,60.96 TP45.TP | 59.69,60.96 v59.69,59.18 | U1.12 54.03,68.25 53.59,67.82 53.59,65.53 55.12,64.01 58.93,64.01 59.69,63.25 59.69,60.96
  Bottom 0.152: v59.69,59.18 U8.2
DIM5  (via drill 0.35)
  Top 0.152: v76.2,59.18 TP50.TP | U1.6 50.76,67.6 v50.8,67.56
  Bottom 0.152: U9.2 v76.2,59.18 76.2,64.01 72.64,67.56 v50.8,67.56
DIM6  (via drill 0.35)
  Top 0.152: v92.71,59.18 TP55.TP 92.71,65.79 90.89,67.6 U1.11
  Bottom 0.152: v92.71,59.18 U10.2
GND
  pour Top: 66.04,110.49 89.92,110.49 arc-90 90.17,110.24 90.17,100.33 66.29,100.33 arc-90 66.04,100.58
GND1  (4 unrouted)
  Top 0.254: C19.2 40.76,94.74 42.93,94.74 43.31,94.36 U5.4 49.66,94.36 50.8,95.5 50.8,99.31 52.07,100.58 57.4,100.58 GND_IN.1
GND2  (via drill 0.35)  (12 unrouted)
  Top 0.152: v21.59,59.18 TP36.TP | TP14.TP v5.08,59.18 | TP41.TP v38.1,59.18 | TP46.TP v54.61,59.18 | TP51.TP v71.12,59.18 | TP56.TP v87.63,59.18
  Top 0.254: C20.2 62.11,94.74 59.94,94.74 59.56,94.36 U5.5 58.04,94.36 TP8.TP | C17.2 45.57,74.04 C18.2 48.75,70.85 U1.1 | C2.2 53.09,75.82 C1.2 | R34.1 85.85,72.9 86.23,72.9 87.12,73.79 U2.3
  Bottom 0.152: U6.4 v21.59,59.18 | v5.08,59.18 U3.4 | v38.1,59.18 U7.4 | v54.61,59.18 U8.4 | v71.12,59.18 U9.4 | v87.63,59.18 U10.4
  other vias: 90.93,75.69 91.82,76.45 92.84,76.45 93.85,76.45 91.57,79.76 92.71,79.76 93.85,79.76 93.98,78.23
  pour Top: 85.09,31.75 99.06,31.75 99.06,40.64 91.44,40.64 91.44,52.07 85.09,52.07
  pour Top: 68.58,52.07 74.93,52.07 74.93,39.37 85.09,39.37 85.09,31.75 68.58,31.75
  pour Top: 52.07,31.75 52.07,52.07 58.42,52.07 58.42,39.37 68.58,39.37 68.58,31.75
  pour Top: 19.05,31.75 35.56,31.75 35.56,39.37 25.4,39.37 25.4,52.07 19.05,52.07
  pour Top: 35.56,31.75 52.07,31.75 52.07,39.37 41.91,39.24 41.91,52.07 35.56,52.07
  pour Top: 19.05,31.75 1.27,31.75 1.27,52.07 8.89,52.07 8.89,39.37 19.05,39.37
  pour Top: 99.06,40.64 99.06,32 arc90 99.31,31.75 114.3,31.75 114.3,110.24 arc90 114.05,110.49 107.95,110.49 107.95,52.07 101.6,52.07 101.6,40.89 arc-90 101.35,40.64
  pour Bottom: 1.27,52.07 8.89,52.07 8.89,39.37 19.05,39.37 19.05,52.07 25.4,52.07 25.4,39.37 35.56,39.37 35.56,52.07 41.91,52.07 41.91,39.37 52.07,39.37 52.07,52.07 58.42,52.07 58.42,39.37 68.58,39.37 68.58,52.07 74.93,52.07 74.93,39.37 85.09,39.37 85.09,52.07 91.44,52.07 91.44,40.64 101.6,40.64 101.6,52.07 107.95,52.07 107.95,110.49 114.3,110.49 114.3,31.75 1.27,31.75
  pour Top (no thermals): 89.53,74.8 89.53,76.33 91.19,76.33 91.19,80.26 94.49,80.26 94.49,73.91 91.31,73.91 91.31,74.8
  pour Top (no thermals): 80.39,80.26 80.39,71.88 86.74,71.88 86.74,72.9 85.09,72.9 85.09,80.26
  pour Bottom: 98.17,80.26 80.39,80.26 80.39,73.91 94.49,73.91 94.49,77.85 98.17,77.85
I2C_3V3  (1 unrouted)
  Top 0.254: U5.1 46.34,98.17 R6.2 R7.2 41.03,98.06 C19.1 3V3_IN.1
I2C_SCL  (1 unrouted)
  Top 0.254: R7.1 44.45,96.01 44.83,95.63 U5.3 49.91,95.63 50.29,96.01 50.29,99.82 SCL_IN.1
I2C_SDA  (1 unrouted)
  Top 0.254: SDA_IN.1 49.78,100.08 49.78,97.28 49.4,96.9 U5.2 47.12,96.9 46.72,96.5 R6.1
N$1
  Top 0.254: U$2.1 54.75,86.99 R3.2
N$2
  Top 0.254: U$2.2 56.02,85.72 R4.2
N$3  (via drill 0.35)
  Top 0.152: TP16.TP v13.97,59.18
  Bottom 0.152: v13.97,59.18 13.97,45.72 U3.1
  pour Top: 17.78,40.64 11.43,40.64 11.43,45.72 10.16,45.72 10.16,52.07 17.78,52.07
N$4
  Top 0.254: U$2.11 65.9,80.64 R9.1
N$5
  pour Top: 16.51,30.48 16.51,13.97 10.16,13.97 10.16,30.48
N$6  (via drill 0.35)
  Top 0.152: v30.48,59.18 TP37.TP
  Bottom 0.152: U6.1 30.48,45.72 v30.48,59.18
  pour Top: 34.29,40.64 27.94,40.64 27.94,46.99 26.67,46.99 26.67,52.07 34.29,52.07
N$7
  Top 0.254: R10.1 23.37,78.74 U4.15
N$8
  Top 0.254: U1.9 57.38,66.3 R18.2
N$9
  pour Top: 33.02,30.48 33.02,13.97 26.67,13.97 26.67,30.48
N$10  (via drill 0.35)
  Top 0.152: TP42.TP v46.99,59.18
  Bottom 0.152: U7.1 46.99,45.72 v46.99,59.18
  pour Top: 50.8,40.64 44.45,40.64 44.45,45.72 43.18,45.72 43.18,52.07 50.8,52.07
N$11
  pour Top: 49.53,30.48 49.53,13.97 43.18,13.97 43.18,30.48
N$12  (via drill 0.35)
  Top 0.152: TP47.TP v63.5,59.18
  Bottom 0.152: v63.5,59.18 63.5,45.72 U8.1
  pour Top: 67.31,40.64 60.96,40.64 60.96,45.72 59.69,45.72 59.69,52.07 67.31,52.07
N$13
  pour Top: 66.04,30.48 59.69,30.48 59.69,13.97 66.04,13.97
N$14  (via drill 0.35)
  Top 0.152: TP52.TP v80.01,59.18
  Bottom 0.152: v80.01,59.18 80.01,45.72 U9.1
  pour Top: 83.82,40.64 77.47,40.64 77.47,46.99 76.2,46.99 76.2,52.07 83.82,52.07
N$15
  pour Top (no thermals): 88.14,73.28 88.14,69.72 84.84,69.72 84.84,71.5 87.12,71.5 87.12,73.28
N$16
  Top 0.254: C2.1 53.09,79.12 C1.1 53.84,79.38 U$2.7 58.28,79.38 R27.1
N$17
  pour Top (no thermals): 80.39,71.5 80.39,69.72 84.45,69.72 84.45,71.5
N$18
  Top 0.152: R12.2 87.36,75.98 U2.18
N$20  (2 unrouted)
N$21
  pour Top: 82.55,13.97 82.55,30.48 76.2,30.48 76.2,13.97
N$22
  Top 0.254: R14.1 23.37,76.2 U4.14
N$23  (2 unrouted)
  Top 0.254: U4.24 23.14,101.83 C3.1
N$24  (via drill 0.35)
  Top 0.152: TP57.TP v96.52,59.18
  Bottom 0.152: v96.52,59.18 96.52,45.72 U10.1
  pour Top: 92.71,52.07 92.71,46.99 93.98,46.99 93.98,41.91 100.33,41.91 100.33,52.07
N$25
  pour Top: 92.71,13.97 99.06,13.97 99.06,30.48 92.71,30.48
N$28
  Top 0.254: R15.1 23.37,73.66 U4.13
N$29  (1 unrouted)
  Top 0.254: U$2.6 48.51,80.64
N$30
  Top 0.254: U4.2 17.78,99.57 U4.21 23.37,93.98 R32.1
N$32
  Top 0.254: U2.17 88.15,76.43 R1.1
N$33
  pour Top (no thermals): 85.47,75.18 87.88,75.18 87.88,74.93 86.23,74.93 86.23,73.28 85.47,73.28
P1  (2 unrouted)
SCL  (3 unrouted)
  Top 0.254: R5.1 57.29,95.63 U5.6 52.2,95.63 51.82,95.25 51.82,92.96 TP7.TP
SDA  (3 unrouted)
  Top 0.254: R2.1 55.86,96.77 54.86,96.77 54.74,96.9 U5.7 51.69,96.9 51.21,96.42 51.21,95.34 49.53,93.66 TP6.TP